# Altium schematic sheet D_Input.SchDoc
size 420 x 297 mm; SheetNumber: 2; SheetTotal: 5
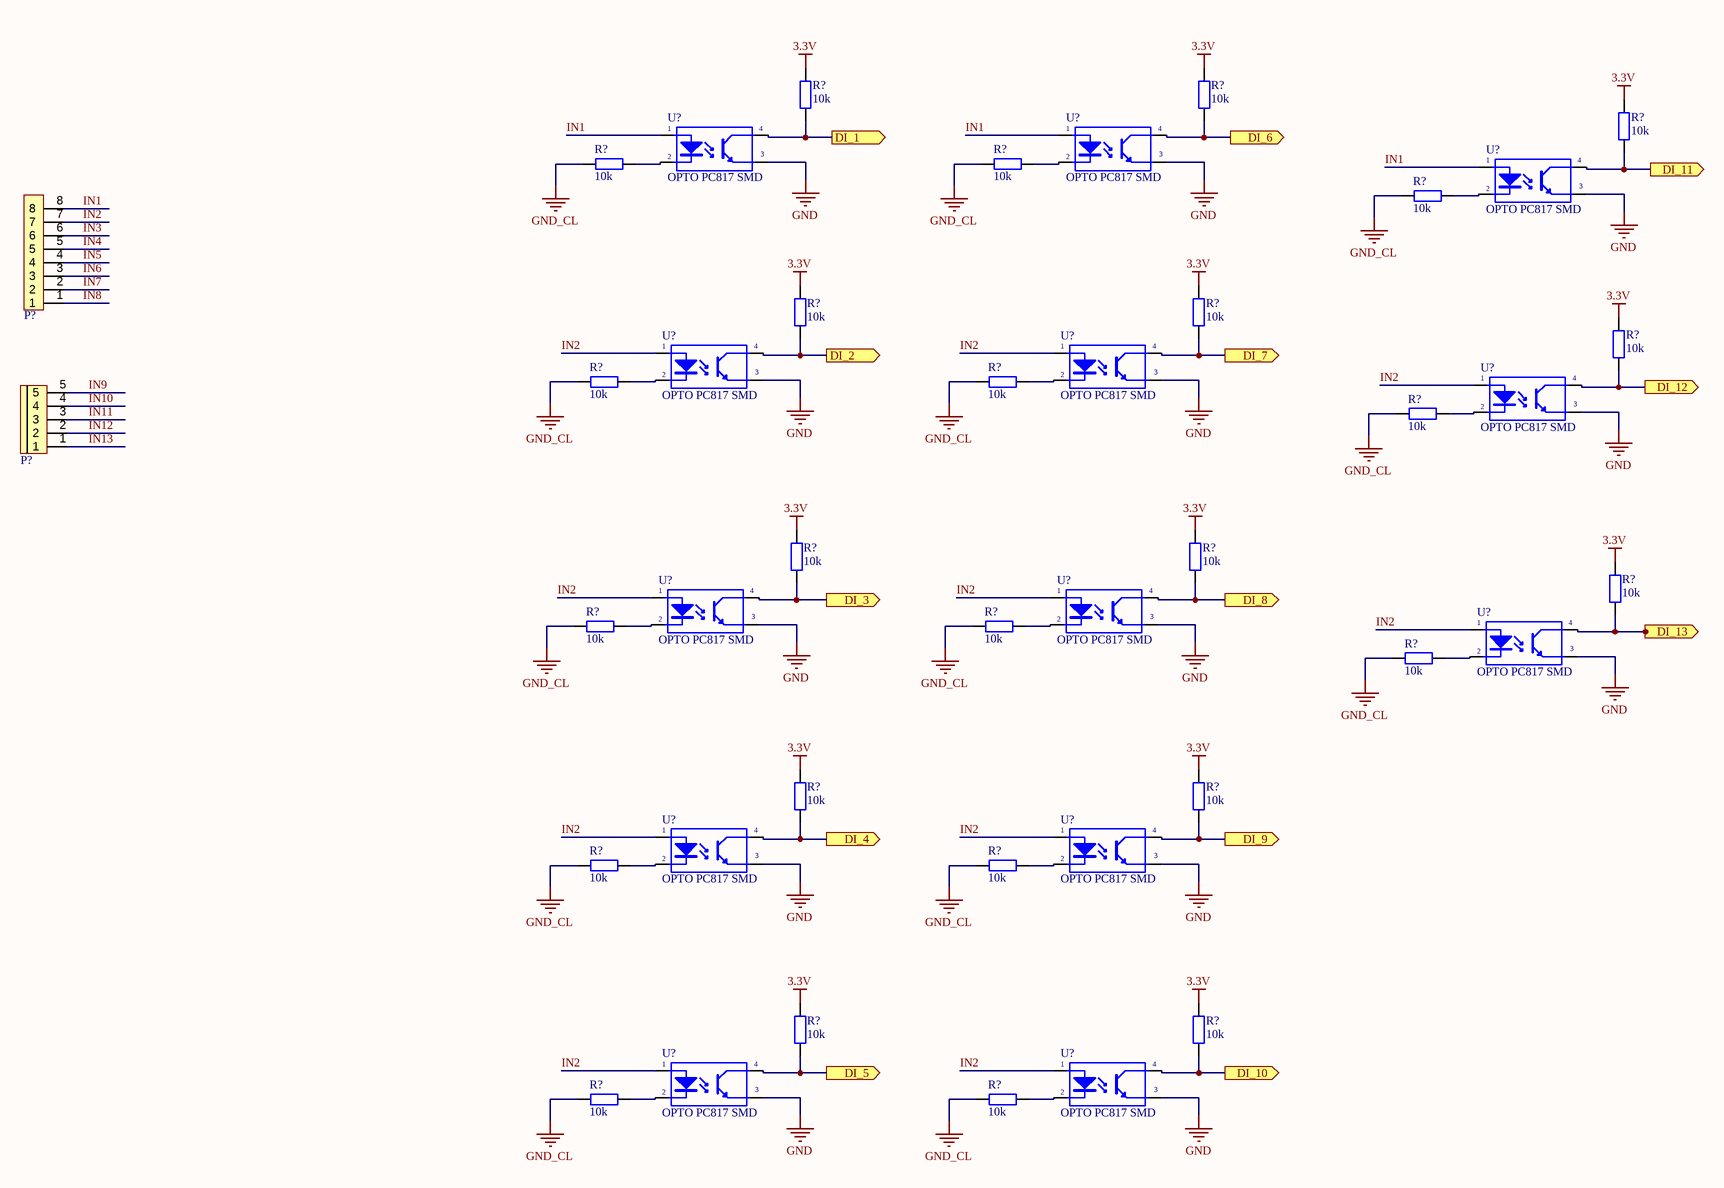
[diagram p0: D_Input.SchDoc]

## Parts
(Parts that share a designator on the sheet are numbered #1, #2 ... from top to bottom, then left to right.)
P?#1  CON 8 EDG5.08  [CON 8 8EDG5.08]  (value not drawn)
P?#2  CON 5 EDG5.08  [CON 5 5EDG5.08]  (value not drawn)
R?#1  10k  [tro smd 0805]
R?#2  10k  [tro smd 0805]
R?#3  10k  [tro smd 0805]
R?#4  10k  [tro smd 0805]
R?#5  10k  [tro smd 0805]
R?#6  10k  [tro smd 0805]
R?#7  10k  [tro smd 0805]
R?#8  10k  [tro smd 0805]
R?#9  10k  [tro smd 0805]
R?#10  10k  [tro smd 0805]
R?#11  10k  [tro smd 0805]
R?#12  10k  [tro smd 0805]
R?#13  10k  [tro smd 0805]
R?#14  10k  [tro smd 0805]
R?#15  10k  [tro smd 0805]
R?#16  10k  [tro smd 0805]
R?#17  10k  [tro smd 0805]
R?#18  10k  [tro smd 0805]
R?#19  10k  [tro smd 0805]
R?#20  10k  [tro smd 0805]
R?#21  10k  [tro smd 0805]
R?#22  10k  [tro smd 0805]
R?#23  10k  [tro smd 0805]
R?#24  10k  [tro smd 0805]
R?#25  10k  [tro smd 0805]
R?#26  10k  [tro smd 0805]
U?#1  OPTO PC817 SMD  [SOP4]
U?#2  OPTO PC817 SMD  [SOP4]
U?#3  OPTO PC817 SMD  [SOP4]
U?#4  OPTO PC817 SMD  [SOP4]
U?#5  OPTO PC817 SMD  [SOP4]
U?#6  OPTO PC817 SMD  [SOP4]
U?#7  OPTO PC817 SMD  [SOP4]
U?#8  OPTO PC817 SMD  [SOP4]
U?#9  OPTO PC817 SMD  [SOP4]
U?#10  OPTO PC817 SMD  [SOP4]
U?#11  OPTO PC817 SMD  [SOP4]
U?#12  OPTO PC817 SMD  [SOP4]
U?#13  OPTO PC817 SMD  [SOP4]

## Ports
DI_1 (out), DI_2 (out), DI_3 (out), DI_4 (out), DI_5 (out), DI_6 (out), DI_7 (out), DI_8 (out), DI_9 (out), DI_10 (out), DI_11 (out), DI_12 (out), DI_13 (out)

## Nets
3.3V: R?#1.1 R?#2.1 R?#3.1 R?#7.1 R?#8.1 R?#9.1 R?#13.1 R?#14.1 R?#15.1 R?#19.1 R?#20.1 R?#23.1 R?#24.1
GND: U?#1.3(E) U?#2.3(E) U?#3.3(E) U?#4.3(E) U?#5.3(E) U?#6.3(E) U?#7.3(E) U?#8.3(E) U?#9.3(E) U?#10.3(E) U?#11.3(E) U?#12.3(E) U?#13.3(E)
GND_CL: R?#4.2 R?#5.2 R?#6.2 R?#10.2 R?#11.2 R?#12.2 R?#16.2 R?#17.2 R?#18.2 R?#21.2 R?#22.2 R?#25.2 R?#26.2
DI_1: R?#1.2 U?#1.4(C) ; port DI_1
DI_2: R?#7.2 U?#4.4(C) ; port DI_2
DI_3: R?#13.2 U?#7.4(C) ; port DI_3
DI_4: R?#19.2 U?#10.4(C) ; port DI_4
DI_5: R?#23.2 U?#12.4(C) ; port DI_5
DI_6: R?#2.2 U?#2.4(C) ; port DI_6
DI_7: R?#8.2 U?#5.4(C) ; port DI_7
DI_8: R?#14.2 U?#8.4(C) ; port DI_8
DI_9: R?#20.2 U?#11.4(C) ; port DI_9
DI_10: R?#24.2 U?#13.4(C) ; port DI_10
DI_11: R?#3.2 U?#3.4(C) ; port DI_11
DI_12: R?#9.2 U?#6.4(C) ; port DI_12
DI_13: R?#15.2 U?#9.4(C) ; port DI_13
IN1: P?#1.8 U?#1.1(A) U?#2.1(A) U?#3.1(A)
IN2: P?#1.7 U?#4.1(A) U?#5.1(A) U?#6.1(A) U?#7.1(A) U?#8.1(A) U?#9.1(A) U?#10.1(A) U?#11.1(A) U?#12.1(A) U?#13.1(A)
IN3: P?#1.6
IN4: P?#1.5
IN5: P?#1.4
IN6: P?#1.3
IN7: P?#1.2
IN8: P?#1.1
IN9: P?#2.5
IN10: P?#2.4
IN11: P?#2.3
IN12: P?#2.2
IN13: P?#2.1
NetR?#4_1: R?#4.1 U?#1.2(K)
NetR?#5_1: R?#5.1 U?#2.2(K)
NetR?#6_1: R?#6.1 U?#3.2(K)
NetR?#10_1: R?#10.1 U?#4.2(K)
NetR?#11_1: R?#11.1 U?#5.2(K)
NetR?#12_1: R?#12.1 U?#6.2(K)
NetR?#16_1: R?#16.1 U?#7.2(K)
NetR?#17_1: R?#17.1 U?#8.2(K)
NetR?#18_1: R?#18.1 U?#9.2(K)
NetR?#21_1: R?#21.1 U?#10.2(K)
NetR?#22_1: R?#22.1 U?#11.2(K)
NetR?#25_1: R?#25.1 U?#12.2(K)
NetR?#26_1: R?#26.1 U?#13.2(K)

## Notes on the sheet
- THIS DOCUMENT AND THE DATA DISCLOSED HEREIN OR
- HEREWITH IS THE PROPERTY OF ALTIUM LIMITED AND MAY
- DWG NO:
- REVISION
- REV:
- DESCRIPTION
- DATE
- APPROVED
- BE FREELY DISTRIBUTED IN WHOLE. NO RIGHTS ARE
- RESERVED OR EXPRESS OR IMPLIED WARANTEE GIVEN.
- ENG:
- APPROVALS
- PROJECT
- DSN:
- CHK:
- REFERENCE DOCUMENTS
- PROJECT REVISION:
- TITLE
- DOCUMENT REVISION:
- DESIGN ITEM:
- BOM:
- FAB DWG:
- PCB DWG:
- ASSY DWG:
- SCALE:
- A3
- SIZE
- CAGE CODE
- FILE NAME
- DWG NO.
- SHEET
- OF
- REV

## Library data of the parts
P?#1 = CON 8 EDG5.08: Cắm; Ten_Linh_Kien: CON 8 2EDG5.08-8P 5.08MM ( Xanh Cong); Ma_Hang: MH000978; Don_Vi: Con; Ghi_Chu: *; Kieu_Chan: *; Chung_Loai: Cắm
P?#2 = CON 5 EDG5.08: Cắm; Ten_Linh_Kien: CON 5 2EDG5.08-5P 5.08MM ( Xanh Cong); Ma_Hang: MH003589; Kieu_Chan: *; Don_Vi: Con; Ghi_Chu: *; Chung_Loai: Cắm
R?#1-R?#26 = Tro 0805 5% 10k: Dán; Don_Vi: Con; So_Chan: 2; Ten_Linh_Kien: Trở 0805 5% 10k; Ma_Hang: MH005239; Chung_Loai: Dán; Kieu_Chan: *
U?#1-U?#13 = OPTO PC817 SMD: Single Opto; Value: PC817